# Altium schematic sheet uC_radio.SchDoc
size A4
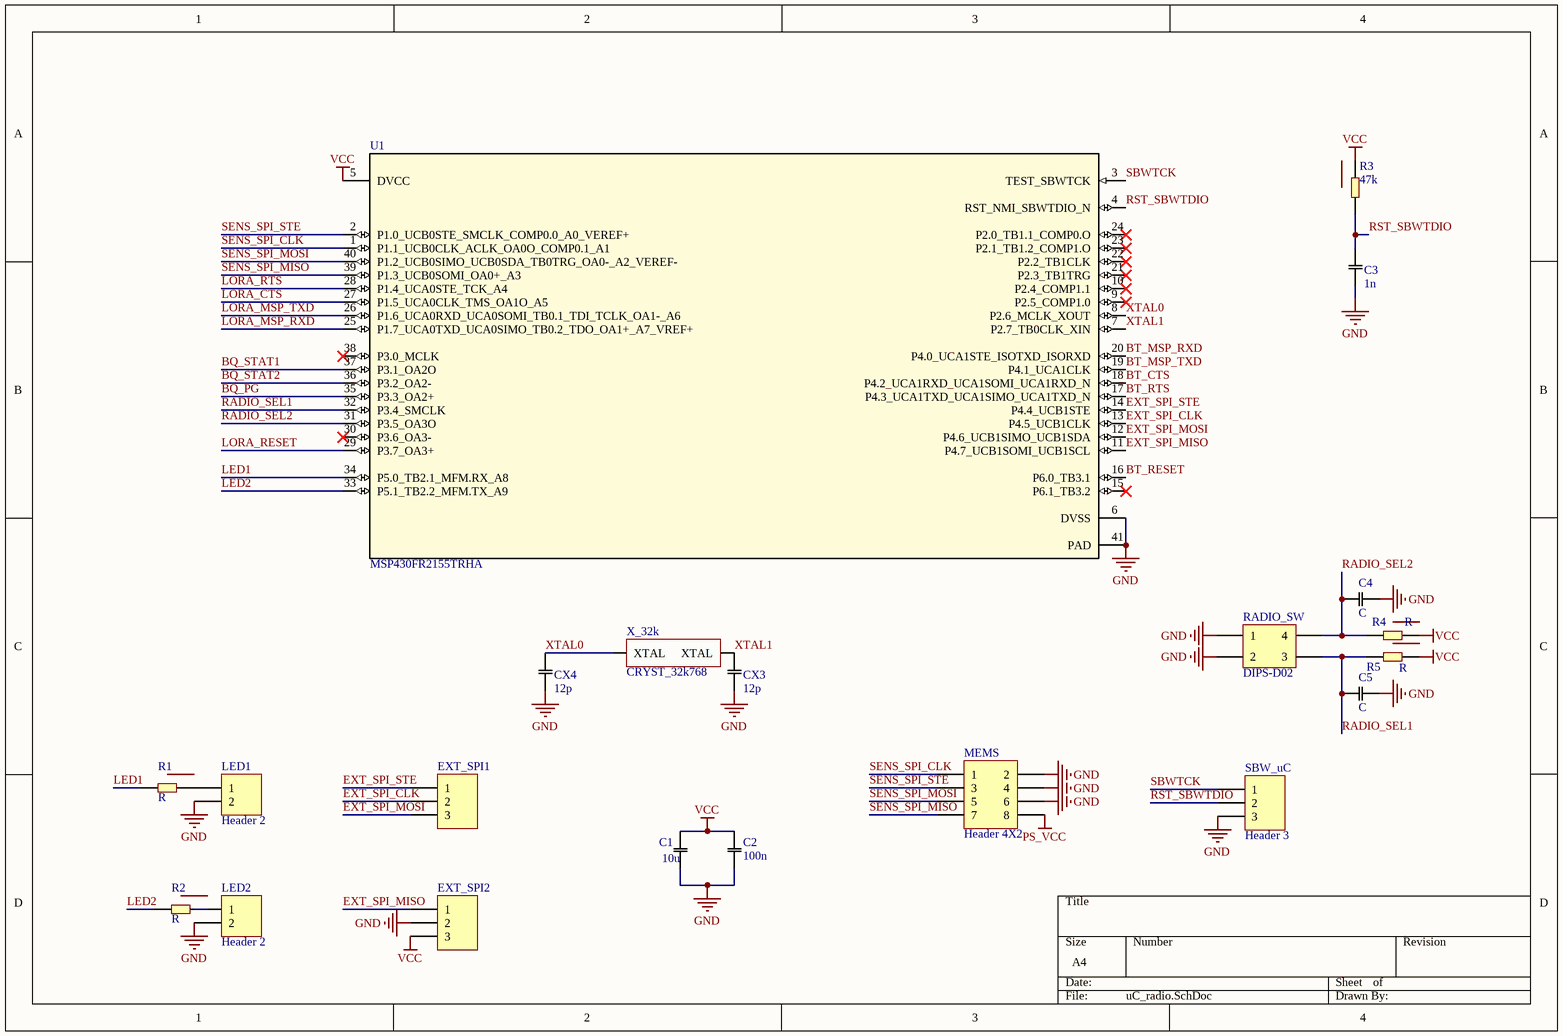
[diagram p0: uC_radio.SchDoc]

## Parts
C1  10u  [402]
C2  100n  [402]
C3  1n  [402]
C4  C  [603]
C5  C  [603]
CX3  12p  [402]
CX4  12p  [402]
EXT_SPI1  (no value)  [HDR1X3]
EXT_SPI2  (no value)  [HDR1X3]
LED1  Header 2  [HDR1X2]
LED2  Header 2  [HDR1X2]
MEMS  Header 4X2  [HDR2X4]
R1  R  [402]
R2  R  [402]
R3  47k  [402]
R4  R  [402]
R5  R  [402]
RADIO_SW  DIPS-D02  [DIPS-02]
SBW_uC  Header 3  [HDR1X3]
U1  MSP430FR2155TRHA  [RHA0040E_NV]
X_32k  CRYST_32k768  [CRYST 32.768 kHz]

## Nets
GND: C1.1 C2.1 C3.1 C4.2 C5.2 CX3.1 CX4.1 EXT_SPI2.2 LED1.2 LED2.2 MEMS.2 MEMS.4 MEMS.6 RADIO_SW.1 RADIO_SW.2 SBW_uC.3 U1.6(DVSS) U1.41(PAD)
PS_VCC: MEMS.8
VCC: C1.2 C2.2 EXT_SPI2.3 R3.2 R4.2 R5.2 U1.5(DVCC)
BQ_PG: U1.35(P3.3_OA2+)
BQ_STAT1: U1.37(P3.1_OA2O)
BQ_STAT2: U1.36(P3.2_OA2-)
BT_CTS: U1.18(P4.2_UCA1RXD_UCA1SOMI_UCA1RXD_N)
BT_MSP_RXD: U1.20(P4.0_UCA1STE_ISOTXD_ISORXD)
BT_MSP_TXD: U1.19(P4.1_UCA1CLK)
BT_RESET: U1.16(P6.0_TB3.1)
BT_RTS: U1.17(P4.3_UCA1TXD_UCA1SIMO_UCA1TXD_N)
EXT_SPI_CLK: EXT_SPI1.2 U1.13(P4.5_UCB1CLK)
EXT_SPI_MISO: EXT_SPI2.1 U1.11(P4.7_UCB1SOMI_UCB1SCL)
EXT_SPI_MOSI: EXT_SPI1.3 U1.12(P4.6_UCB1SIMO_UCB1SDA)
EXT_SPI_STE: EXT_SPI1.1 U1.14(P4.4_UCB1STE)
LED1: R1.1 U1.34(P5.0_TB2.1_MFM.RX_A8)
LED2: R2.1 U1.33(P5.1_TB2.2_MFM.TX_A9)
LORA_CTS: U1.27(P1.5_UCA0CLK_TMS_OA1O_A5)
LORA_MSP_RXD: U1.25(P1.7_UCA0TXD_UCA0SIMO_TB0.2_TDO_OA1+_A7_VREF+)
LORA_MSP_TXD: U1.26(P1.6_UCA0RXD_UCA0SOMI_TB0.1_TDI_TCLK_OA1-_A6)
LORA_RESET: U1.29(P3.7_OA3+)
LORA_RTS: U1.28(P1.4_UCA0STE_TCK_A4)
RADIO_SEL1: C5.1 R5.1 RADIO_SW.3 U1.32(P3.4_SMCLK)
RADIO_SEL2: C4.1 R4.1 RADIO_SW.4 U1.31(P3.5_OA3O)
RST_SBWTDIO: C3.2 R3.1 SBW_uC.2 U1.4(RST_NMI_SBWTDIO_N)
SBWTCK: SBW_uC.1 U1.3(TEST_SBWTCK)
SENS_SPI_CLK: MEMS.1 U1.1(P1.1_UCB0CLK_ACLK_OA0O_COMP0.1_A1)
SENS_SPI_MISO: MEMS.7 U1.39(P1.3_UCB0SOMI_OA0+_A3)
SENS_SPI_MOSI: MEMS.5 U1.40(P1.2_UCB0SIMO_UCB0SDA_TB0TRG_OA0-_A2_VEREF-)
SENS_SPI_STE: MEMS.3 U1.2(P1.0_UCB0STE_SMCLK_COMP0.0_A0_VEREF+)
XTAL0: CX4.2 U1.8(P2.6_MCLK_XOUT) X_32k.2(XTAL)
XTAL1: CX3.2 U1.7(P2.7_TB0CLK_XIN) X_32k.1(XTAL)
NetLED1_1: LED1.1 R1.2
NetLED2_1: LED2.1 R2.2

Not connected (* = marked no-connect by the designer): U1 9(P2.5_COMP1.0)* 10(P2.4_COMP1.1)* 15(P6.1_TB3.2)* 21(P2.3_TB1TRG)* 22(P2.2_TB1CLK)* 23(P2.1_TB1.2_COMP1.O)* 24(P2.0_TB1.1_COMP0.O)* 30(P3.6_OA3-)* 38(P3.0_MCLK)*

## Library data of the parts
C1-C5 CX3 CX4 = C: Capacitor
EXT_SPI1 EXT_SPI2 SBW_uC = Header 3: Header, 3-Pin; LatestRevisionDate: 17-Jul-2002; LatestRevisionNote: Re-released for DXP Platform.; Publisher: Altium Limited
LED1 LED2 = Header 2: Header, 2-Pin; LatestRevisionDate: 17-Jul-2002; LatestRevisionNote: Re-released for DXP Platform.; Publisher: Altium Limited
MEMS = Header 4X2: Header, 4-Pin, Dual row; LatestRevisionDate: 17-Jul-2002; LatestRevisionNote: Re-released for DXP Platform.; Publisher: Altium Limited
R1-R5 = R: Resistor
U1 = MSP430FR2155TRHA: Imported; Manufacturer: Texas Instruments; PartNumber: MSP430FR2355TRHAR; RefDes: RefDes; TYPE: TYPE; Value: Value